# Altium schematic sheet Main.SchDoc: RC_LPF_PI
size A4; DocumentNumber: 2; SheetNumber: 1; SheetTotal: 2
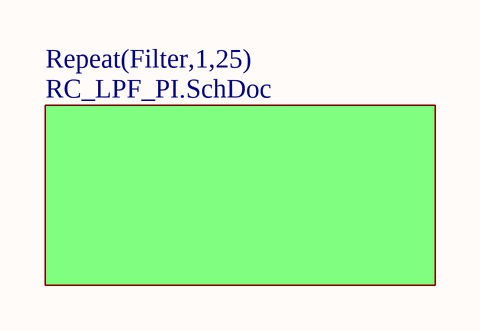
[diagram p0: Main.SchDoc]

## Sub-sheets
Repeat(Filter,1,25) = RC_LPF_PI.SchDoc: no entries

## Notes on the sheet
- DOCUMENT NAME:
- TITLE:
- This document is created by Mitai. Any further questions can be asked through
- AUTHOR :
- REVIEWER:
- Sheet
- PART NO.:
- of
- *
- DATE:
- TEMPLATE:
- team@mitai.ai.
- A4
- Contact Address:Rosenheimer Straße 116b,81669, München.